# EAGLE design ESP-32-UNICLOCK-Nixi-V2 (EAGLE 6.3)
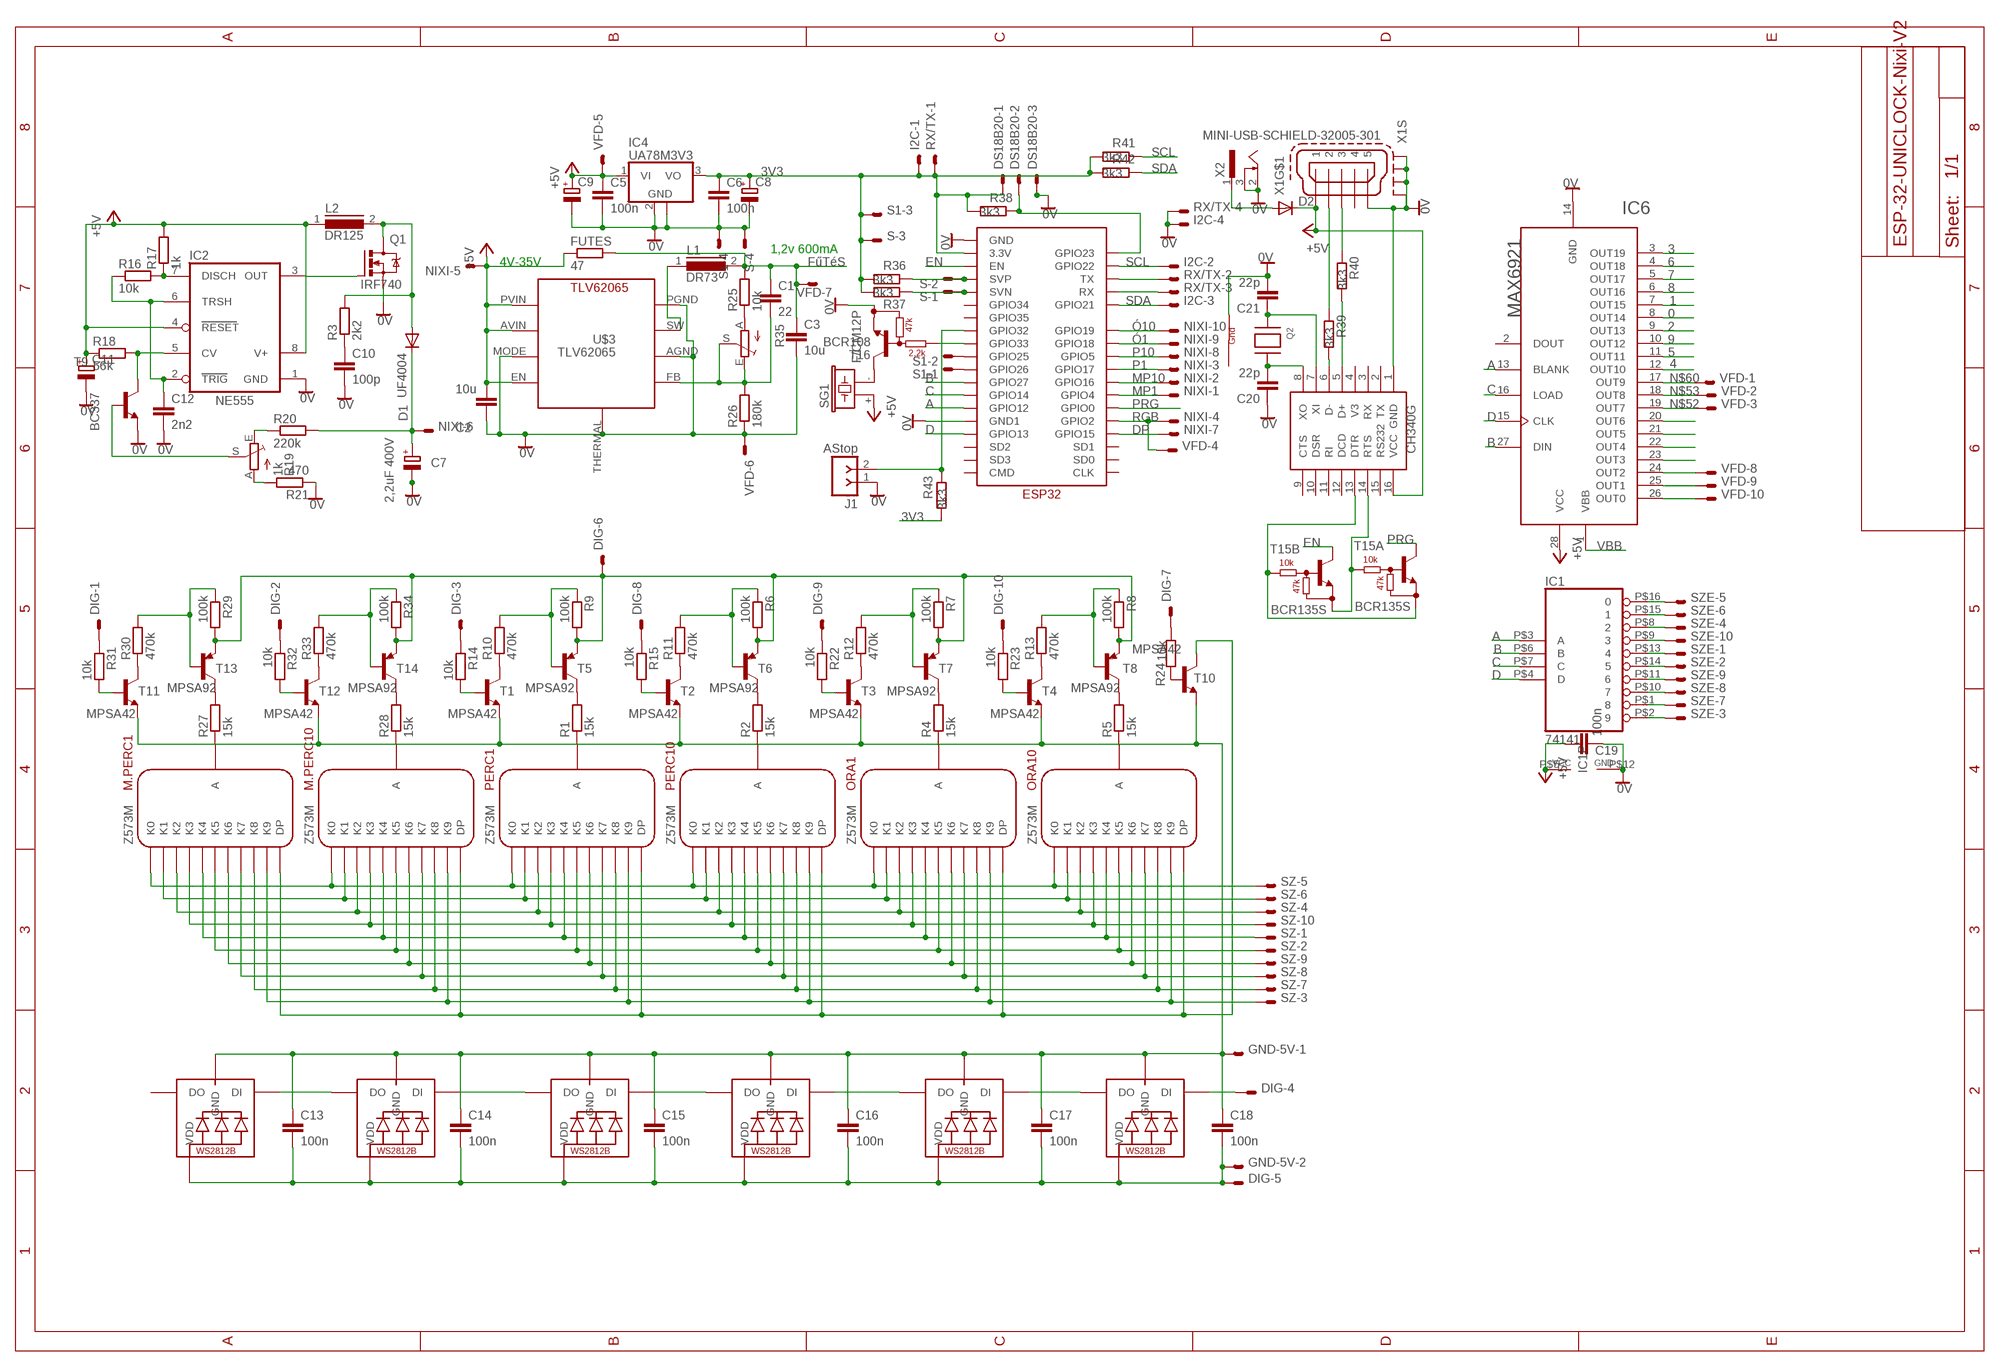
[diagram p0: schematic, sheet 1]

## Parts
C1  22  C0603  [0603]
C2  10u  C1206  [1206]
C3  10u  C1206  [1206]
C5  100n  C0603  [0603]
C6  100n  C0603  [0603]
C7  2,2uF 400V  CPOL-EUE2.5-7  [E2,5-7]
C8  CPOL-EUE2.5-5  [E2,5-5]
C9  CPOL-EUE2.5-5  [E2,5-5]
C10  100p  C-EU050-024X044  [C050-024X044]
C11  CPOL-EUE2.5-7  [E2,5-7]
C12  2n2  C-EUC0603  [C0603]
C13  100n  C-EUC0603  [C0603]
C14  100n  C-EUC0603  [C0603]
C15  100n  C-EUC0603  [C0603]
C16  100n  C-EUC0603  [C0603]
C17  100n  C-EUC0603  [C0603]
C18  100n  C-EUC0603  [C0603]
C19  100n  C0603  [0603]
C20  22p  C0603  [0603]
C21  22p  C0603  [0603]
D1  UF4004  BA221  [DO35-10]
D2  DIODE-SOD123  [SOD123]
DIG  DIG  PAD10  [PAD10]
DS18B20  PAD3  [PAD3]
FUTES  47  R-EU_0207/10  [0207/10]
GND-5V  PAD2  [PAD2]
I2C  PAD4  [PAD4]
IC1  74141  [DIL16SMD]
IC2  NE555  ICM7555  [DIL08]
IC4  UA78M3V3  UA78M05DCY  [SOT223]
IC6  MAX6921  MAX6921SOIC28W  [SO-28W]
J1  AStop  F-1X02-SIP-100-32  [SIP-100-02-32]
L1  DR73  [DR73]
L2  DR125  [DR125]
LED1  WS2812B_5050N  [WS2812B-NARROW]
LED2  WS2812B_5050N  [WS2812B-NARROW]
LED3  WS2812B_5050N  [WS2812B-NARROW]
LED4  WS2812B_5050N  [WS2812B-NARROW]
LED5  WS2812B_5050N  [WS2812B-NARROW]
LED6  WS2812B_5050N  [WS2812B-NARROW]
M.PERC1  MP1  Z573SZ1  [Z573SZ1]
M.PERC10  MP10  Z573SZ1  [Z573SZ1]
NIXI  PAD10  [PAD10]
ORA1  O1  Z573SZ1  [Z573SZ1]
ORA10  O10  Z573SZ1  [Z573SZ1]
PERC1  P1  Z573SZ1  [Z573SZ1]
PERC10  P10  Z573SZ1  [Z573SZ1]
Q1  IRF740  [TO220BV]
Q2  XTAL-4-3225  [NX3225]
R1  15k  R-EU_0207/7  [0207/7]
R2  15k  R-EU_0207/7  [0207/7]
R3  2k2  R-EU_0204/7  [0204/7]
R4  15k  R-EU_0207/7  [0207/7]
R5  15k  R-EU_0207/7  [0207/7]
R6  100k  R-EU_0207/7  [0207/7]
R7  100k  R-EU_0207/7  [0207/7]
R8  100k  R-EU_0207/7  [0207/7]
R9  100k  R-EU_0207/7  [0207/7]
R10  470k  R-EU_0207/7  [0207/7]
R11  470k  R-EU_0207/7  [0207/7]
R12  470k  R-EU_0207/7  [0207/7]
R13  470k  R-EU_0207/7  [0207/7]
R14  10k  R-EU_0207/7  [0207/7]
R15  10k  R-EU_0207/7  [0207/7]
R16  10k  R-EU_R0603  [R0603]
R17  1k  R-EU_R0603  [R0603]
R18  56k  R-EU_R0603  [R0603]
R19  1k  TRIM_EU-CA6H  [CA6H]
R20  220k  R-EU_0204/7  [0204/7]
R21  470  R-EU_0204/7  [0204/7]
R22  10k  R-EU_0207/7  [0207/7]
R23  10k  R-EU_0207/7  [0207/7]
R24  10k  R-EU_0207/7  [0207/7]
R25  10k  R0603  [0603]
R26  180k  R0603  [0603]
R27  15k  R-EU_0207/7  [0207/7]
R28  15k  R-EU_0207/7  [0207/7]
R29  100k  R-EU_0207/7  [0207/7]
R30  470k  R-EU_0207/7  [0207/7]
R31  10k  R-EU_0207/7  [0207/7]
R32  10k  R-EU_0207/7  [0207/7]
R33  470k  R-EU_0207/7  [0207/7]
R34  100k  R-EU_0207/7  [0207/7]
R35  TRIM_EU-B25P  [B25P]
R36  3k3  R0603  [0603]
R37  3k3  R0603  [0603]
R38  3k3  R0603  [0603]
R39  3k3  R0603  [0603]
R40  3k3  R0603  [0603]
R41  3k3  R0603  [0603]
R42  3k3  R0603  [0603]
R43  3k3  R0603  [0603]
RX/TX  PAD4  [PAD4]
S  PAD4  [PAD4]
S1  PAD4  [PAD4]
SG1  F/CM12P  [F/CM12P]
SZ  PAD10  [PAD10]
SZE  PAD10  [PAD10]
T1  MPSA42  BC317-NPN-TO92-EBC  [TO92-EBC]
T2  MPSA42  BC317-NPN-TO92-EBC  [TO92-EBC]
T3  MPSA42  BC317-NPN-TO92-EBC  [TO92-EBC]
T4  MPSA42  BC317-NPN-TO92-EBC  [TO92-EBC]
T5  MPSA92  BC328-PNP-TO92-EBC  [TO92-EBC]
T6  MPSA92  BC328-PNP-TO92-EBC  [TO92-EBC]
T7  MPSA92  BC328-PNP-TO92-EBC  [TO92-EBC]
T8  MPSA92  BC328-PNP-TO92-EBC  [TO92-EBC]
T9  BC337  BC237-NPN-TO92-CBE  [TO92-CBE]
T10  MPSA42  BC317-NPN-TO92-EBC  [TO92-EBC]
T11  MPSA42  BC317-NPN-TO92-EBC  [TO92-EBC]
T12  MPSA42  BC317-NPN-TO92-EBC  [TO92-EBC]
T13  MPSA92  BC328-PNP-TO92-EBC  [TO92-EBC]
T14  MPSA92  BC328-PNP-TO92-EBC  [TO92-EBC]
T15  BCR135S  [SOT363_INFINEON]
T16  BCR108  [SOT23-BEC]
U$1  CH340G  [SOIC16]
U$2  ESP32-2X18  [ESP322X18]
U$3  TLV62065  [TLV62065]
VFD  PAD10  [PAD10]
X1  MINI-USB-SCHIELD-32005-301  [32005-301]
X2  733989-5  [733989-5]

## Nets
0: IC1.P$16 IC6.8(OUT14) SZE.P$5
0V: C2.2 C3.2 C5.2 C6.2 C7.- C8.- C9.- C10.2 C11.- C12.2 C19.2 C20.1 C21.2 DS18B20.P$3 I2C.P$4 IC1.P$12(GND) IC2.1(GND) IC4.2(GND) IC4.4(GND) IC6.14(GND) J1.1 Q1.S Q2.4(G1) R21.1 R26.1 RX/TX.P$4 S1.P$4 S.P$4 T9.E T16.E U$1.1(GND) U$2.P$19(GND) U$2.P$26(GND1) U$3.AGND U$3.MODE U$3.PGND U$3.THERMAL VFD.P$6 X1.5 X1.M1(S:S1) X1.M2(S:S2) X1.M3(S:S3) X1.M4(S:S4) X2.2 X2.3
1: IC1.P$15 IC6.7(OUT15) SZE.P$6
2: IC1.P$8 IC6.9(OUT13) SZE.P$4
3: IC1.P$9 IC6.3(OUT19) SZE.P$10
3V3: C6.1 C8.+ DS18B20.P$1 I2C.P$1 IC4.3(VO) R36.2 R37.2 R38.2 R41.2 R42.2 R43.2 RX/TX.P$1 S1.P$3 S.P$3 U$2.P$20(3.3V)
4: IC1.P$13 IC6.12(OUT10) SZE.P$1
5: IC1.P$14 IC6.11(OUT11) SZE.P$2
6: IC1.P$11 IC6.4(OUT18) SZE.P$9
7: IC1.P$10 IC6.5(OUT17) SZE.P$8
8: IC1.P$1 IC6.6(OUT16) SZE.P$7
9: IC1.P$2 IC6.10(OUT12) SZE.P$3
+5V: C2.1 C5.1 C9.+ C11.+ C19.1 D2.C FUTES.1 IC1.P$5(VCC) IC2.4(RESET) IC2.8(V+) IC4.1(VI) IC6.28(VCC) L2.1 NIXI.P$5 R17.2 R18.1 SG1.+ U$1.16(VCC) U$3.AVIN U$3.EN U$3.PVIN VFD.P$5 X1.1
A: IC1.P$3(A) IC6.13(BLANK) U$2.P$12(GPIO12)
B: IC1.P$6(B) IC6.27(DIN) U$2.P$10(GPIO27)
C: IC1.P$7(C) IC6.16(LOAD) U$2.P$9(GPIO14)
D: IC1.P$4(D) IC6.15(CLK) U$2.P$11(GPIO13)
DP: NIXI.P$7 U$2.P$35(GPIO15)
EN: T15.3(B:C) U$2.P$21(EN)
FűTéS: C1.1 C3.1 FUTES.2 L1.2 R25.2 VFD.P$7
GND1: C13.1 C14.1 C15.1 C16.1 C17.1 C18.1 GND-5V.P$1 LED1.3-GND(GND) LED2.3-GND(GND) LED3.3-GND(GND) LED4.3-GND(GND) LED5.3-GND(GND) LED6.3-GND(GND) T1.E T2.E T3.E T4.E T10.E T11.E T12.E
MP1: NIXI.P$1 U$2.P$34(GPIO4)
MP10: NIXI.P$2 U$2.P$31(GPIO16)
N$1: T15.1(A:E) T15.5(B:B) U$1.13(DTR)
N$2: S1.P$1 U$2.P$7(GPIO26)
N$3: IC6.26(OUT0) VFD.P$10
N$4: IC6.25(OUT1) VFD.P$9
N$6: L1.1 U$3.SW
N$8: IC6.24(OUT2) VFD.P$8
N$10: PERC1.A R1.1
N$11: PERC10.A R2.1
N$12: ORA1.A R4.1
N$13: ORA10.A R5.1
N$14: R1.2 T5.C
N$15: R2.2 T6.C
N$16: R4.2 T7.C
N$17: R5.2 T8.C
N$18: R19.E R20.1
N$19: R10.1 T1.C
N$20: R19.A R21.2
N$21: R9.1 R10.2 T5.B
N$22: IC2.3(OUT) Q1.G
N$23: IC2.7(DISCH) R16.2 R17.1
N$24: C12.1 IC2.2(TRIG) IC2.6(TRSH) R16.1
N$25: R6.1 R11.2 T6.B
N$26: IC2.5(CV) R18.2 T9.C
N$27: C10.1 R3.1
N$28: R37.1 S.P$1 U$2.P$1(SVN)
N$29: R7.1 R12.2 T7.B
N$30: R8.1 R13.2 T8.B
N$31: R11.1 T2.C
N$32: R12.1 T3.C
N$33: R13.1 T4.C
N$34: R14.2 T1.B
N$35: R15.2 T2.B
N$36: R22.2 T3.B
N$37: R23.2 T4.B
N$38: R24.2 T10.B
N$39: DIG.P$1 R31.1
N$40: DIG.P$6 R6.2 R7.2 R8.2 R9.2 R29.2 R34.2 T5.E T6.E T7.E T8.E T13.E T14.E
N$41: DIG.P$2 R32.1
N$42: M.PERC1.K0 M.PERC10.K0 ORA1.K0 ORA10.K0 PERC1.K0 PERC10.K0 SZ.P$5
N$43: IC6.23(OUT3)
N$44: D1.A L2.2 Q1.D R3.2
N$45: M.PERC1.K1 M.PERC10.K1 ORA1.K1 ORA10.K1 PERC1.K1 PERC10.K1 SZ.P$6
N$46: DS18B20.P$2 R38.1 U$2.P$23(GPIO23)
N$47: DIG.P$8 R15.1
N$48: DIG.P$10 R23.1
N$49: IC6.22(OUT4)
N$50: IC6.21(OUT5)
N$51: IC6.20(OUT6)
N$52: IC6.19(OUT7) VFD.P$3
N$53: IC6.18(OUT8) VFD.P$2
N$54: LED1.2-DOUT(DO) LED2.4-DIN(DI)
N$55: LED2.2-DOUT(DO) LED3.4-DIN(DI)
N$56: M.PERC1.K2 M.PERC10.K2 ORA1.K2 ORA10.K2 PERC1.K2 PERC10.K2 SZ.P$4
N$57: M.PERC1.K3 M.PERC10.K3 ORA1.K3 ORA10.K3 PERC1.K3 PERC10.K3 SZ.P$10
N$58: M.PERC1.K4 M.PERC10.K4 ORA1.K4 ORA10.K4 PERC1.K4 PERC10.K4 SZ.P$1
N$59: M.PERC1.K5 M.PERC10.K5 ORA1.K5 ORA10.K5 PERC1.K5 PERC10.K5 SZ.P$2
N$60: IC6.17(OUT9) VFD.P$1
N$61: M.PERC1.K6 M.PERC10.K6 ORA1.K6 ORA10.K6 PERC1.K6 PERC10.K6 SZ.P$9
N$62: M.PERC1.K7 M.PERC10.K7 ORA1.K7 ORA10.K7 PERC1.K7 PERC10.K7 SZ.P$8
N$63: M.PERC1.K8 M.PERC10.K8 ORA1.K8 ORA10.K8 PERC1.K8 PERC10.K8 SZ.P$7
N$64: M.PERC1.K9 M.PERC10.K9 ORA1.K9 ORA10.K9 PERC1.K9 PERC10.K9 SZ.P$3
N$65: LED3.2-DOUT(DO) LED4.4-DIN(DI)
N$66: LED4.2-DOUT(DO) LED5.4-DIN(DI)
N$67: DIG.P$9 R22.1
N$68: DIG.P$7 R24.1
N$69: DIG.P$3 R14.1
N$70: D2.A X2.1
N$71: DIG.P$4 LED1.4-DIN(DI)
N$72: R36.1 S.P$2 U$2.P$2(SVP)
N$73: S1.P$2 U$2.P$8(GPIO25)
N$74: R39.1 X1.2
N$75: R40.2 U$1.5(D+)
N$76: R39.2 U$1.6(D-)
N$77: R40.1 X1.3
N$78: LED5.2-DOUT(DO) LED6.4-DIN(DI)
N$79: T15.2(A:B) T15.4(B:E) U$1.14(RTS)
N$80: C20.2 Q2.3(X2) U$1.8(XO)
N$81: C13.2 C14.2 C15.2 C16.2 C17.2 C18.2 DIG.P$5 GND-5V.P$2 LED1.1-VDD(VDD) LED2.1-VDD(VDD) LED3.1-VDD(VDD) LED4.1-VDD(VDD) LED5.1-VDD(VDD) LED6.1-VDD(VDD)
N$82: M.PERC1.A R27.1
N$83: M.PERC10.A R28.1
N$84: R27.2 T13.C
N$85: R28.2 T14.C
N$86: R30.1 T11.C
N$87: R31.2 T11.B
N$88: R32.2 T12.B
N$89: C21.1 Q2.1(X1) U$1.7(XI)
N$90: R29.1 R30.2 T13.B
N$91: R33.2 R34.1 T14.B
N$92: RX/TX.P$2 U$2.P$22(TX)
N$93: RX/TX.P$3 U$2.P$24(RX)
N$94: SG1.- T16.C
N$95: T16.B U$2.P$5(GPIO33)
N$96: J1.2 R43.1 U$2.P$6(GPIO32)
N$98: R25.1 R35.A
N$99: C1.2 R26.2 R35.E R35.S U$3.FB
N$104: R33.1 T12.C
N$105: M.PERC1.DP M.PERC10.DP ORA1.DP ORA10.DP PERC1.DP PERC10.DP T10.C
N$119: R19.S T9.B
P1: NIXI.P$3 U$2.P$32(GPIO17)
P10: NIXI.P$8 U$2.P$29(GPIO5)
PRG: T15.6(A:C) U$2.P$33(GPIO0)
RGB: NIXI.P$4 U$2.P$36(GPIO2) VFD.P$4
SCL: I2C.P$2 R41.1 U$2.P$25(GPIO22)
SDA: I2C.P$3 R42.1 U$2.P$28(GPIO21)
VBB: C7.+ D1.C IC6.1(VBB) NIXI.P$6 R20.2
Ó1: NIXI.P$9 U$2.P$30(GPIO18)
Ó10: NIXI.P$10 U$2.P$27(GPIO19)
Unconnected: IC6.2(DOUT) LED6.2-DOUT(DO) U$1.2(TX) U$1.3(RX) U$1.4(V3) U$1.9(CTS) U$1.10(DSR) U$1.11(RI) U$1.12(DCD) U$1.15(RS232) U$2.P$3(GPIO35) U$2.P$4(GPIO34) U$2.P$13(SD3) U$2.P$14(SD2) U$2.P$15(CLK) U$2.P$16(CMD) U$2.P$17(SD1) U$2.P$18(SD0) X1.4

## Notes on the sheet
- 1,2v 600mA
- 4V-35V

## Power pins joined to a net without a drawn wire
G2: Q2.2(G2)

## Library data of the parts
C1-C3 C5 C6 C19-C21 =  Zozo:C
C7-C9 C11 = resistor:CPOL-EU: POLARIZED CAPACITOR, European symbol
C10 C12-C18 = resistor:C-EU: CAPACITOR, European symbol
D1 = diode:BA221: DIODE high speed (Philips)
D2 = diode:DIODE-: DIODE
DIG NIXI SZ SZE VFD = tuskesor:PAD10
DS18B20 = tuskesor:PAD3
FUTES R1-R18 R20-R24 R27-R34 = resistor:R-EU_: RESISTOR, European symbol
GND-5V = tuskesor:PAD2
I2C RX/TX S S1 = tuskesor:PAD4
IC1 = 74xx-eu:74*141: BCD to decimal DECODER/DRIVER
IC2 = maxim1:ICM7555: TIMER; MF: MAXIM; MPN: ICM7555IPA+; OC_FARNELL: 9663762; OC_NEWARK: 68K4387
IC4 = linear:UA78M*: POSITIVE-VOLTAGE REGULATORS Source: http://focus.ti.com/lit/ds/symlink/ua78m33.pdf
IC6 = JVN:MAX6921
J1 = con-headers-jp:F-1X02-: FEMALE HEADER
L1 = inductors:DR73: High Power Density, High Efficiency, Shielded Inductors Source: coiltronics_dr_series.pdf
L2 = inductors:DR125: High Power Density, High Efficiency, Shielded Inductors Source: coiltronics_dr_series.pdf
LED1-LED6 = adafruit:WS2812B
M.PERC1 M.PERC10 ORA1 ORA10 PERC1 PERC10 =    Z573M:Z573SZ1
Q1 = transistor-power:IRF740: N-CHANNEL MOS FET
Q2 = adafruit:XTAL-4: Classic 4-pin 3.2 x 2.5mm crystal
R19 R35 = pot:TRIM_EU-: POTENTIOMETER
R25 R26 R36-R43 =  Zozo:R
SG1 = buzzer:F/CM12P: BUZZER Source: Buerklin; OC_FARNELL: unknown; OC_NEWARK: unknown
T1-T4 T9-T12 = transistor:*-NPN-: NPN Transistror BF959 corrected 2008.03.06
T5-T8 T13 T14 = transistor:*-PNP-: PNP Transistror
T15 = digital-transistors-1:BCR135S: Dual NPN Silicon Digital Transistor 50V 0,1A 0,25W
T16 = digital-transistors:BCR108: NPN Silicon Digital Transistor 50V 0,1A 0,2W
U$1 = ch340g:CH340G
U$2 = ESP32:ESP32-2X18
U$3 = LMR23630:TLV62065
X1 = con-cypressindustries:MINI-USB-SCHIELD-: MINI USB-B Conector Source: www.cypressindustries.com; OC_FARNELL: unknown; OC_NEWARK: unknown
X2 = con-conrad:73398?: FEMALE PRINT CONNECTOR Niedervolt-Steckverbinder Distributor Conrad

## Board
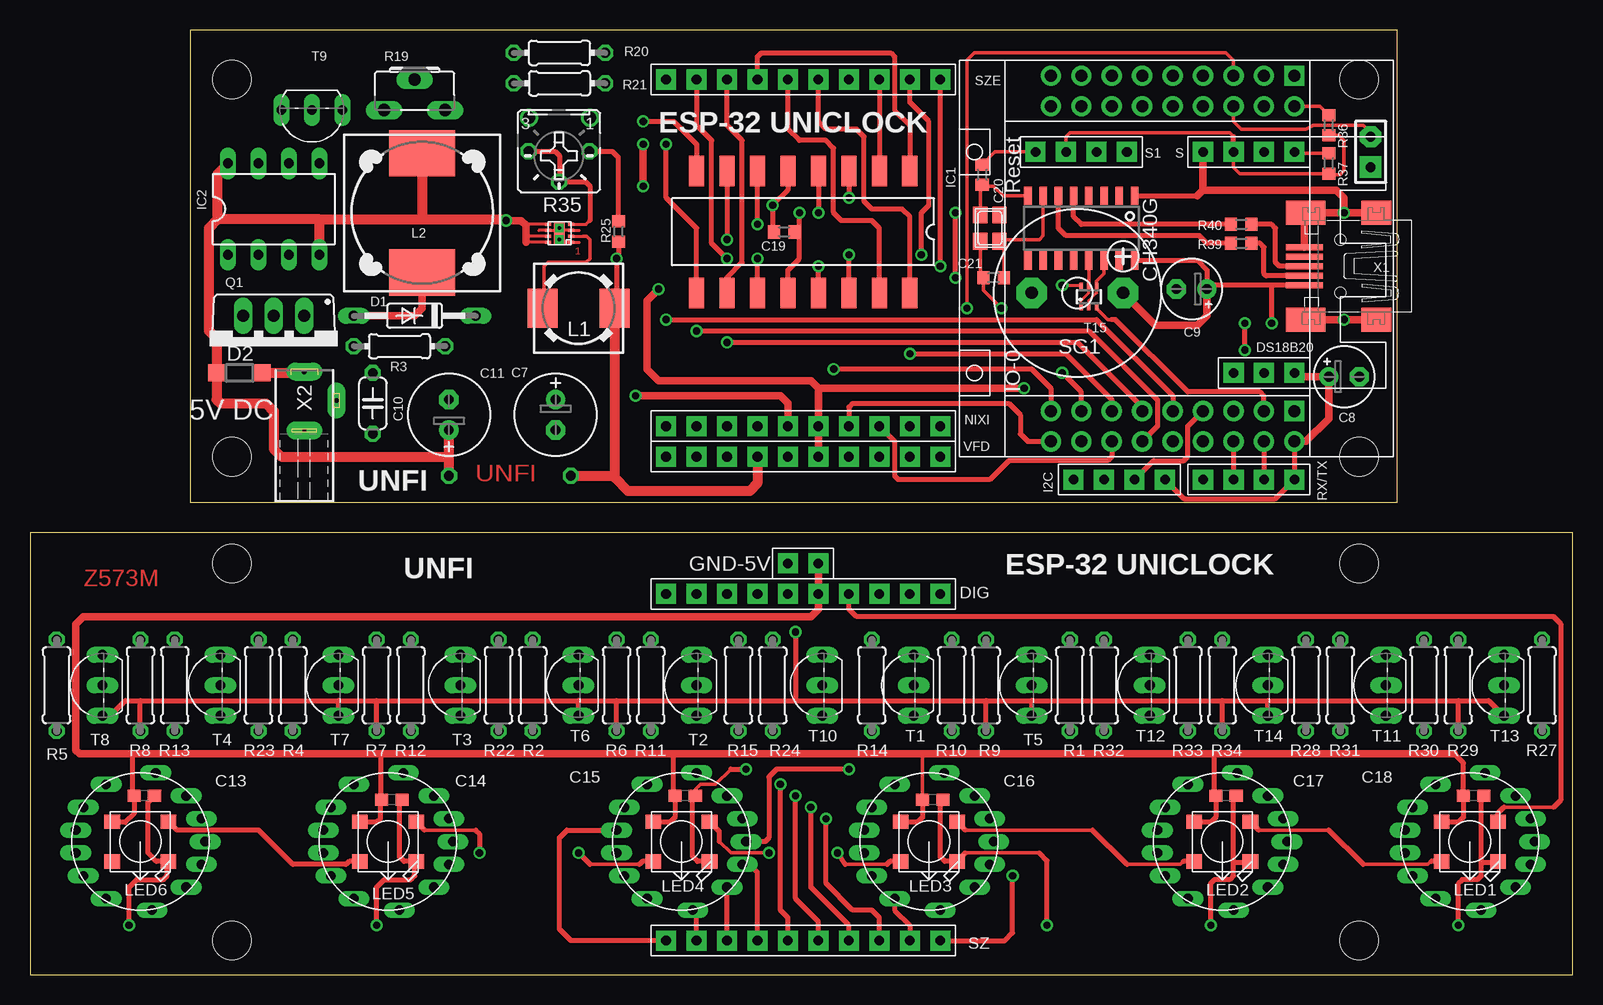
[diagram p1: board, top side]
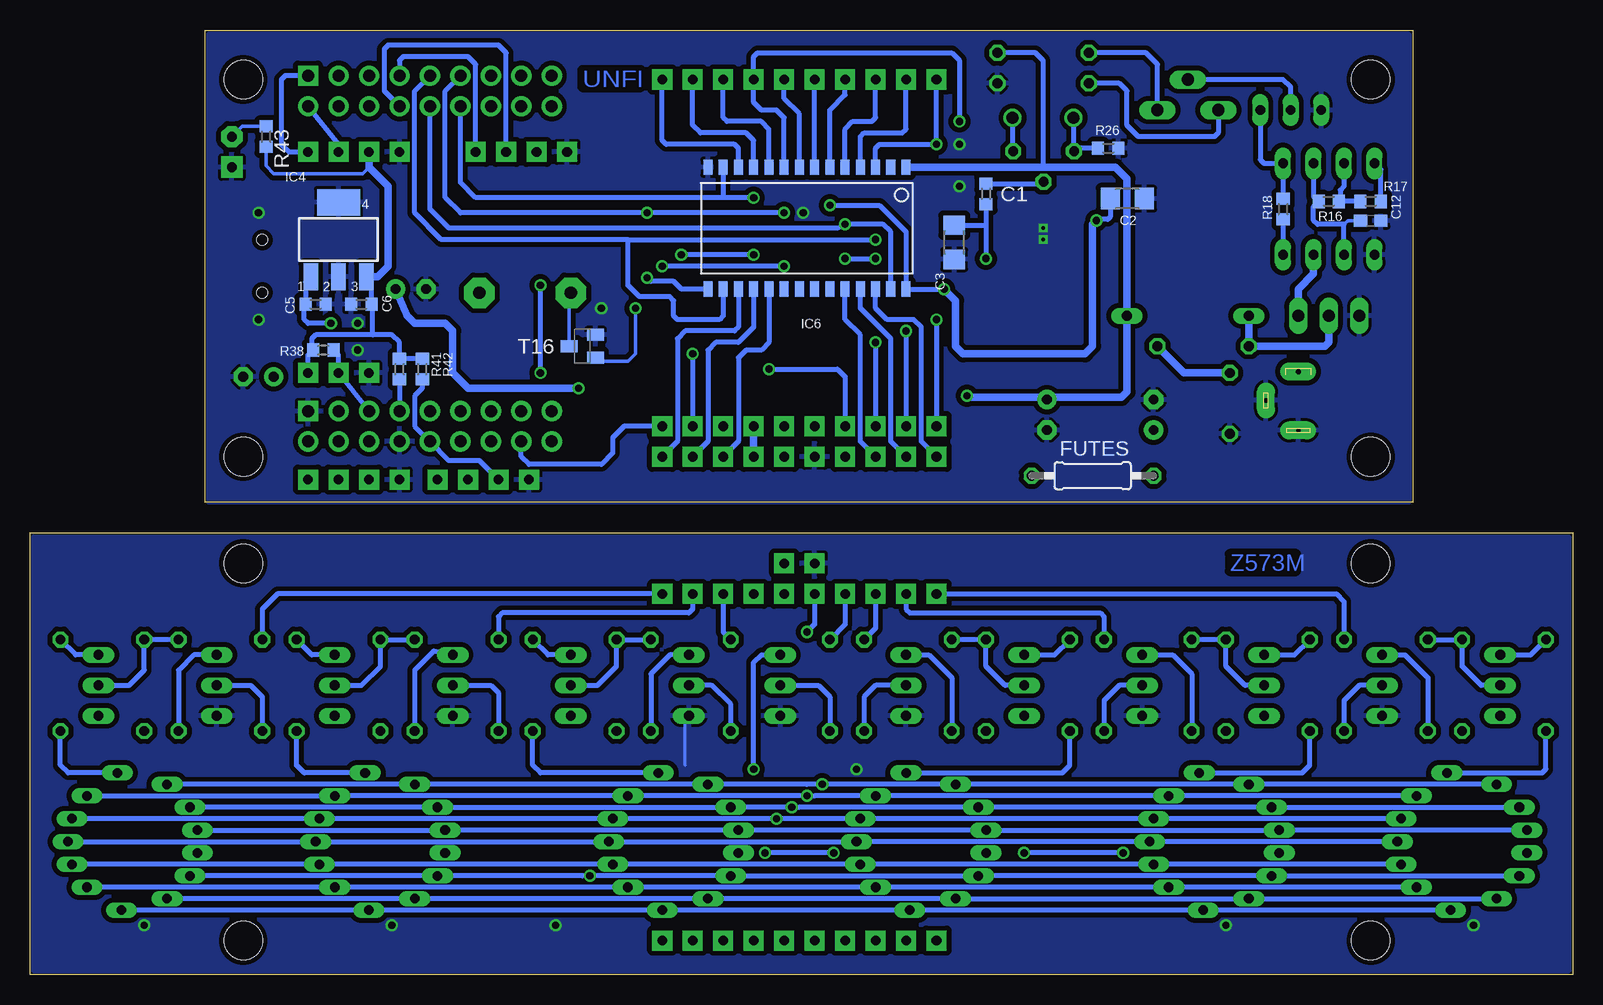
[diagram p2: board, bottom side, seen from below]

Size 128.59 x 78.74 mm. Coordinates in mm from the lower left corner, seen from the top.
Outline: 0,0 128.59,0 128.59,36.83 0,36.83 0,0
Outline: 13.33,39.37 113.98,39.37 113.98,78.74 13.33,78.74 13.33,39.37
Copper layers (1*16): Top 0.035mm / dielectric 1.5mm / Bottom 0.035mm
Design rules "default *": minimum track width 10mil, minimum drill 24mil, track to track 8mil, track to pad 8mil, pad to pad 8mil, via to via 8mil, smd to smd 8mil, copper to edge 0mil, drill to drill 8mil, minimum pad ring 10mil, minimum via ring 8mil, stop-mask expansion 4mil, vias tented up to drill 0mil, thermal gap 10mil
Holes 3.2 mm at 16.83,74.61 16.83,43.18 110.81,43.18 110.81,74.61 110.81,34.29 16.83,34.29 16.83,2.86 110.81,2.86

### Footprints (pad centres in the part's own frame; a part is rotated, then mirrored left to right if it is on the bottom)
0603 = smd 1 x 1.1: 1 -0.85,0; 2 0.85,0
1206 = smd 1.6 x 1.803: 1 -1.422,0; 2 1.422,0
E2,5-7 = drill 0.813 pad 1.6: + -1.27,0 | drill 0.813 pad 1.6 octagon: - 1.27,0
E2,5-5 = drill 0.813 pad 1.6: + -1.27,0 | drill 0.813 pad 1.6 octagon: - 1.27,0
C050-024X044 = drill 0.813 octagon: 1 -2.54,0; 2 2.54,0
C0603 = smd 1.1 x 1: 1 -0.85,0; 2 0.85,0
DO35-10 = drill 0.813 long: A 5.08,0; C -5.08,0
SOD123 = smd 1.4 x 1.4: A 1.9,0; C -1.9,0
PAD10 = drill 0.8 pad 1.676 square: P$1 0,0; P$2 2.54,0; P$3 5.08,0; P$4 7.62,0; P$5 10.16,0; P$6 12.7,0; P$7 15.24,0; P$8 17.78,0; P$9 20.32,0; P$10 22.86,0
PAD3 = drill 0.8 pad 1.676 square: P$1 0,0; P$2 2.54,0; P$3 5.08,0
0207/10 = drill 0.813 octagon: 1 -5.08,0; 2 5.08,0
PAD2 = drill 0.8 pad 1.676 square: P$1 0,0; P$2 2.54,0
PAD4 = drill 0.8 pad 1.676 square: P$1 0,0; P$2 2.54,0; P$3 5.08,0; P$4 7.62,0
DIL16SMD = smd 1.27 x 2.54: P$1 0,0; P$2 2.54,0; P$3 5.08,0; P$4 7.62,0; P$5 10.16,0; P$6 12.7,0; P$7 15.24,0; P$8 17.78,0; P$9 17.78,10.16; P$10 15.24,10.16; P$11 12.7,10.16; P$12 10.16,10.16; P$13 7.62,10.16; P$14 5.08,10.16; P$15 2.54,10.16; P$16 0,10.16
DIL08 = drill 0.813 long: 1 -3.81,-3.81; 2 -1.27,-3.81; 3 1.27,-3.81; 4 3.81,-3.81; 5 3.81,3.81; 6 1.27,3.81; 7 -1.27,3.81; 8 -3.81,3.81
SOT223 = smd 1.219 x 2.235: 1 -2.311,-3.099; 2 0,-3.099; 3 2.311,-3.099 | smd 3.6 x 2.2: 4 0,3.099
SO-28W = smd 0.762 x 1.27: 1 -8.255,-5.08; 2 -6.985,-5.08; 3 -5.715,-5.08; 4 -4.445,-5.08; 5 -3.175,-5.08; 6 -1.905,-5.08; 7 -0.635,-5.08; 8 0.635,-5.08; 9 1.905,-5.08; 10 3.175,-5.08; 11 4.445,-5.08; 12 5.715,-5.08; 13 6.985,-5.08; 14 8.255,-5.08; 15 8.255,5.08; 16 6.985,5.08; 17 5.715,5.08; 18 4.445,5.08; 19 3.175,5.08; 20 1.905,5.08; 21 0.635,5.08; 22 -0.635,5.08; 23 -1.905,5.08; 24 -3.175,5.08; 25 -4.445,5.08; 26 -5.715,5.08; 27 -6.985,5.08; 28 -8.255,5.08
SIP-100-02-32 = drill 0.813 pad 1.778 square: 1 -1.27,0 | drill 0.813 pad 1.778 octagon: 2 1.27,0
DR73 = smd 2.5 x 3.25: 1 -3,0; 2 3,0
DR125 = smd 3.85 x 5.5: 1 -4.975,0; 2 4.975,0
WS2812B-NARROW = smd 1.3 x 1.2: 1-VDD 2.35,-1.65; 2-DOUT 2.35,1.65; 3-GND -2.35,1.65; 4-DIN -2.35,-1.65
Z573SZ1 = drill 0.8 pad 1.27 long: A 1.27,5.715; DP 5.397,0; IC -5.397,-0.953; K0 3.81,3.81; K1 -2.857,4.763; K2 -4.763,2.857; K3 -5.397,0.953; K4 -4.763,-2.857; K5 -2.857,-4.763; K6 0.953,-5.715; K7 3.81,-3.81; K8 5.08,-1.905; K9 5.08,1.905
TO220BV = drill 1.016 long: D 0,-2.54; G -2.54,-2.54; S 2.54,-2.54
NX3225 = smd 1.4 x 1.2: 1 -1.1,-0.8; 2 1.1,-0.8; 3 1.1,0.8; 4 -1.1,0.8
0207/7 = drill 0.813 octagon: 1 -3.81,0; 2 3.81,0
0204/7 = drill 0.813 octagon: 1 -3.81,0; 2 3.81,0
R0603 = smd 1 x 1.1: 1 -0.85,0; 2 0.85,0
CA6H = drill 1.016 long: A -2.54,0; E 2.54,0; S 0,2.54
B25P = drill 0.813 octagon: A -2.54,0; E 2.54,0; S 0,2.54
F/CM12P = drill 1.016 pad 2.54 octagon: + 3.81,0; - -3.81,0
TO92-EBC = drill 0.813 long: B 0,-1.27; C 2.54,-1.27; E -2.54,-1.27
TO92-CBE = drill 0.813 long: B 0,0; C -2.54,0; E 2.54,0
SOT363_INFINEON = smd 0.3 x 0.7: 1 -0.65,-0.8; 2 0,-0.8; 3 0.65,-0.8; 4 0.65,0.8; 5 0,0.8; 6 -0.65,0.8
SOT23-BEC = smd 1 x 1.4: B -0.95,-1.1; C 0,1.1; E 0.95,-1.1
SOIC16 = smd 0.635 x 1.524: 1 -4.445,-2.695; 2 -3.175,-2.695; 3 -1.905,-2.695; 4 -0.635,-2.695; 5 0.635,-2.695; 6 1.905,-2.695; 7 3.175,-2.695; 8 4.445,-2.695; 9 4.445,2.695; 10 3.175,2.695; 11 1.905,2.695; 12 0.635,2.695; 13 -0.635,2.695; 14 -1.905,2.695; 15 -3.175,2.695; 16 -4.445,2.695
ESP322X18 = drill 1 pad 1.676 square: P$1 0,0; P$19 27.94,0 | drill 1 pad 1.676: P$2 2.54,0; P$3 0,-2.54; P$4 2.54,-2.54; P$5 0,-5.08; P$6 2.54,-5.08; P$7 0,-7.62; P$8 2.54,-7.62; P$9 0,-10.16; P$10 2.54,-10.16; P$11 0,-12.7; P$12 2.54,-12.7; P$13 0,-15.24; P$14 2.54,-15.24; P$15 0,-17.78; P$16 2.54,-17.78; P$17 0,-20.32; P$18 2.54,-20.32; P$20 30.48,0; P$21 27.94,-2.54; P$22 30.48,-2.54; P$23 27.94,-5.08; P$24 30.48,-5.08; P$25 27.94,-7.62; P$26 30.48,-7.62; P$27 27.94,-10.16; P$28 30.48,-10.16; P$29 27.94,-12.7; P$30 30.48,-12.7; P$31 27.94,-15.24; P$32 30.48,-15.24; P$33 27.94,-17.78; P$34 30.48,-17.78; P$35 27.94,-20.32; P$36 30.48,-20.32
TLV62065 = smd 0.5 x 0.25: AGND 0,0.5; AVIN 1.9,1; EN 1.9,0; FB 0,0; MODE 1.9,0.5; PGND 0,1.5; PVIN 1.9,1.5; SW 0,1 | smd 0.9 x 1.9: THERMAL 0.96,0.76
32005-301 = smd 3.1 x 0.5: 1 3,1.6; 2 3,0.8; 3 3,0; 4 3,-0.8; 5 3,-1.6 | smd 2.5 x 2: M1 -3,-4.45; M2 -3,4.45 | smd 3.3 x 2: M3 2.9,4.45; M4 2.9,-4.45 | hole 0.9: 0,2.2; 0,-2.2
733989-5 = drill 0.4 pad 1.5 long: 1 0,5.82; 3 2.7,3.42 | drill 0.3 pad 1.5 long: 2 0,0.92

### Placement (x,y rotation side)
C1  48.89,65.09 90 bottom
C2  37.1,64.69 0 bottom
C3  51.54,61.04 270 bottom
C5  104.78,55.88 0 bottom
C6  100.97,55.88 180 bottom
C7  43.81,46.67 270 top
C8  109.54,49.85 0 top
C9  96.84,57.15 180 top
C10  28.57,47.62 270 top
C11  34.92,46.67 90 top
C12  16.83,62.86 0 bottom
C13  9.52,14.92 180 top
C14  30.16,14.61 180 top
C15  54.61,14.92 180 top
C16  75.25,14.61 180 top
C17  99.7,14.92 180 top
C18  120.33,14.92 180 top
C19  62.86,61.91 0 top
C20  79.38,66.67 270 top
C21  80.33,58.1 180 top
D1  32.07,54.93 180 top
D2  17.46,50.16 0 top
DIG  75.88,31.75 180 top
DS18B20  105.41,50.16 180 top
FUTES  40,41.59 180 bottom
GND-5V  63.18,34.29 0 top
I2C  94.62,41.27 180 top
IC1  73.34,66.99 180 top
IC2  20.32,63.82 0 top
IC4  102.87,61.28 0 bottom
IC6  63.82,62.23 180 bottom
J1  111.76,68.58 90 top
L1  45.72,55.56 0 top
L2  32.7,63.5 270 top
LED1  120.02,11.11 180 top
LED2  99.38,11.11 180 top
LED3  74.93,11.11 180 top
LED4  54.29,11.11 180 top
LED5  29.84,11.11 180 top
LED6  9.21,11.11 180 top
M.PERC1  120.02,11.11 0 top
M.PERC10  99.38,11.11 0 top
NIXI  75.88,45.72 180 top
ORA1  29.84,11.11 0 top
ORA10  9.21,11.11 0 top
PERC1  74.93,11.11 0 top
PERC10  54.29,11.11 0 top
Q1  20.32,52.39 180 top
Q2  80.01,62.23 90 top
R1  86.68,24.13 90 top
R2  41.91,24.13 90 top
R3  30.8,52.39 180 top
R4  21.91,24.13 90 top
R5  2.22,24.13 90 top
R6  48.89,24.13 270 top
R7  28.89,24.13 270 top
R8  9.21,24.13 270 top
R9  79.69,24.13 270 top
R10  76.83,24.13 90 top
R11  51.75,24.13 90 top
R12  31.75,24.13 90 top
R13  12.06,24.13 90 top
R14  70.17,24.13 270 top
R15  59.06,24.13 270 top
R16  20.32,64.45 0 bottom
R17  16.83,64.45 0 bottom
R18  24.13,63.82 90 bottom
R19  32.07,72.07 0 top
R20  44.13,76.84 0 top
R21  44.13,74.3 180 top
R22  39.05,24.13 270 top
R23  19.05,24.13 270 top
R24  61.91,24.13 270 top
R25  49.06,61.95 270 top
R26  38.7,68.87 180 bottom
R27  126.05,24.13 90 top
R28  106.36,24.13 90 top
R29  119.06,24.13 270 top
R30  116.2,24.13 90 top
R31  109.22,24.13 270 top
R32  89.53,24.13 270 top
R33  96.52,24.13 90 top
R34  99.38,24.13 270 top
R35  44.09,68.64 180 top
R36  108.27,70.8 270 top
R37  108.27,67.63 270 top
R38  104.14,52.07 180 bottom
R39  100.97,60.96 180 top
R40  100.97,62.55 180 top
R41  97.79,50.48 90 bottom
R42  95.89,50.48 90 bottom
R43  108.9,69.85 270 bottom
RX/TX  105.41,41.27 180 top
S  105.41,68.58 180 top
S1  91.44,68.58 180 top
SG1  87.31,56.83 0 top
SZ  75.88,2.86 180 top
SZE  75.88,74.61 180 top
T1  72.39,24.13 90 top
T2  54.29,24.13 90 top
T3  34.61,24.13 90 top
T4  14.61,24.13 90 top
T5  82.23,24.13 90 top
T6  44.45,24.13 90 top
T7  24.45,24.13 90 top
T8  4.76,24.13 90 top
T9  23.49,72.07 180 top
T10  64.77,24.13 90 top
T11  111.76,24.13 90 top
T12  92.08,24.13 90 top
T13  121.6,24.13 90 top
T14  101.92,24.13 90 top
T15  88.27,56.52 0 top
T16  82.55,52.39 90 bottom
U$1  87.63,62.23 180 top
U$2  105.41,74.93 270 top
U$3  45.09,62.55 180 top
VFD  75.88,43.18 180 top
X1  109.22,59.05 180 top
X2  22.86,44.45 0 top

### Tracks (layer width: path | path; a pad name or v marks a point on that pad's centre or on a via)
0
  Top 0.406: IC1.P$16 73.34,63.18 72.71,63.82 70.17,63.82 69.53,64.45 69.53,69.85 68.9,70.49 66.36,70.49 65.72,71.12 SZE.P$5
  Bottom 0.406: IC6.8 64.45,71.75 65.72,73.03 SZE.P$5
0V  (via drill 0.3, 0.6)
  Top 0.254: U$3.MODE 44.13,62.05 | U$3.AGND 44.13,62.05 | 44.13,62.05 U$3.THERMAL v44.13,62.23 | U$3.PGND 44.13,61.05 v44.13,61.28
  Top 0.305: S1.P$4 80.43,68.58 C20.1 | Q2.4 79.21,58.37 C21.2 79.48,57.05 v80.96,55.56
  Top 0.406: IC1.P$12 63.18,58.74 64.14,59.69 64.14,61.91 | 64.14,61.91 v64.14,63.5 | C19.2 64.14,61.91 | U$1.1 97.31,64.92 | v101.28,52.07 v101.28,54.29
  Top 0.61: v51.12,65.72 v51.12,69.21 | X1.M2 v109.54,54.6 v109.54,54.61 v109.53,54.6 X1.M3 | X1.M1 v109.54,63.5 | v109.54,63.5 v109.53,63.5 X1.M4 106.22,63.41 X1.5 | S.P$4 97.79,65.41 | 97.79,65.41 97.31,64.92 | 97.79,65.41 108.9,65.41 109.54,64.77 v109.54,63.5
  pour Bottom (isolate 0.406): 13.65,39.37 113.67,39.37 113.67,78.42 13.65,78.42
1
  Top 0.406: IC1.P$15 70.8,62.23 70.17,62.86 67.63,62.86 66.99,63.5 66.99,68.9 66.36,69.53 64.14,69.53 63.18,70.49 SZE.P$6
  Bottom 0.406: IC6.7 SZE.P$6
2  (via drill 0.6)
  Top 0.406: v51.12,71.12 53.66,71.12 55.56,69.21 IC1.P$8
  Bottom 0.406: IC6.9 65.72,71.44 66.36,72.07 67.63,72.07 68.26,72.71 SZE.P$4 68.26,76.52 67.94,76.84 51.75,76.84 51.12,76.2 v51.12,71.12
3  (via drill 0.6)
  Top 0.406: IC1.P$9 55.56,62.23 53.02,64.77 v53.02,69.21
  Bottom 0.406: IC6.3 58.1,68.9 57.79,69.21 v53.02,69.21 SZE.P$10
3V3
  Top 0.305: S1.P$3 86.36,69.85 86.68,70.17 100.01,70.17 100.33,69.85 | S.P$3 100.33,67.31 100.86,66.78 R37.2 108.37,66.67 109.22,66.67 109.54,66.99 109.54,69.53 109.12,69.95 R36.2
  Top 0.406: S.P$3 100.33,69.85 | U$2.P$20 RX/TX.P$1 103.82,39.69 96.2,39.69 I2C.P$1
  Top 0.61: U$2.P$20 106.36,44.45 108.27,46.35 C8.+ 106.04,49.85 DS18B20.P$1
  Bottom 0.305: R43.2 108.9,67.41 R37.2 100.86,66.78 100.49,67.15 100.49,68.42 S.P$3
  Bottom 0.406: IC4.3 100.12,57.74 C6.1 100.01,55.78 100.01,53.34 | DS18B20.P$1 105.41,51.65 R38.2 105.09,52.17 105.09,53.02 104.78,53.34 100.01,53.34 | R42.2 R41.2 97.79,52.71 98.42,53.34 100.01,53.34
  Bottom 0.61: IC4.3 99.62,58.18 98.74,59.06 98.74,65.72 100.33,67.31 S.P$3
4  (via drill 0.6)
  Top 0.406: IC1.P$13 v65.72,59.06 | v75.88,59.06 SZE.P$1
  Bottom 0.406: v65.72,59.06 v75.88,59.06 | IC6.12 69.53,68.9 69.85,69.21 75.57,69.21 75.88,69.53 SZE.P$1
5  (via drill 0.6)
  Top 0.406: IC1.P$14 v68.26,60.01 | v74.29,60.01 74.29,63.5 74.93,64.13 74.93,71.12 73.34,72.71 SZE.P$2
  Bottom 0.406: IC6.11 68.26,69.53 68.9,70.17 72.71,70.17 73.34,70.8 SZE.P$2 | v68.26,60.01 v74.29,60.01
6  (via drill 0.6)
  Top 0.406: SZE.P$9 55.56,70.8 56.83,69.53 56.83,60.96 v58.1,59.69 | IC1.P$11 v60.64,59.69
  Bottom 0.406: IC6.4 59.37,69.85 59.06,70.17 55.88,70.17 55.56,70.49 SZE.P$9 | v60.64,59.69 v58.1,59.69
7
  Top 0.406: IC1.P$10 58.1,58.1 59.37,59.37 59.37,69.53 58.1,70.8 SZE.P$8
  Bottom 0.406: IC6.5 60.64,70.49 60.01,71.12 58.42,71.12 58.1,71.44 SZE.P$8
8
  Top 0.406: SZE.P$7 60.64,76.52 60.96,76.84 71.75,76.84 72.07,76.52 72.07,72.07 73.34,70.8 IC1.P$1
  Bottom 0.406: IC6.6 61.91,72.07 60.64,73.34 SZE.P$7
9
  Top 0.406: SZE.P$3 IC1.P$2
  Bottom 0.406: IC6.10 66.99,70.49 67.63,71.12 70.49,71.12 70.8,71.44 SZE.P$3
+5V  (via drill 0.6)
  Top 0.254: U$3.EN 41.59,62.55 | 41.32,61.55 U$3.AVIN 41.41,61.55 41.36,61.6 | U$3.PVIN 41.36,61.05
  Top 0.305: 41.59,62.55 41.45,62.55 41.36,62.46
  Top 0.406: IC1.P$5 63.18,65.41 v61.91,64.13 61.91,62.02 C19.1 | U$1.16 97.31,59.53 98.11,58.74 C9.+ 98.41,57.46 103.51,57.46 | X1.1 103.51,57.46 | v103.51,54.29 103.51,57.46
  Top 0.61: v52.39,57.15 51.43,56.2 51.43,50.48 52.39,49.53 65.09,49.53 65.72,48.89 | 39.59,62.97 v39.69,62.86 40.96,62.86 41.36,62.46 41.36,61.6 41.36,61.05 | 65.72,48.89 v82.87,48.89 | 65.72,48.89 NIXI.P$5 VFD.P$5 | D2.C | SG1.+ 93.82,54.13 97.31,54.13 98.11,54.93 C9.+
  Top 0.813: 32.7,62.97 39.59,62.97 | L2.1 32.7,62.97 | R18.1 15.66,62.97 | IC2.4 R18.1 | R18.1 32.7,62.97 | 34.93,43.18 20.96,43.18 20.32,43.81 20.32,46.99 19.68,47.63 15.88,47.63 15.56,47.94 D2.C 15.56,53.02 14.92,53.66 14.92,62.23 15.66,62.97 | 34.93,43.18 C11.+ | FUTES.1 34.93,43.18 | 15.66,62.97 15.66,66.78 IC2.8
  Bottom 0.406: v52.39,57.15 IC6.28 55.56,61.91 57.79,64.13 v61.91,64.13 | R17.2 15.98,67.1 IC2.8 | R18.1 IC2.4 | IC4.1 105.62,57.74 C5.1 105.73,55.78 105.73,54.61 105.41,54.29 v103.51,54.29 | C2.1 38.53,63.18 38.73,62.97 39.59,62.97 v39.69,62.86
  Bottom 0.61: v52.39,57.15 51.43,56.2 51.43,52.39 50.8,51.75 40.64,51.75 40,52.39 40,62.55 v39.69,62.86 | v82.87,48.89 92.07,48.89 93.34,50.17 93.34,53.66 93.98,54.29 96.52,54.29 97.15,54.93 C9.+
A  (via drill 0.6)
  Top 0.406: IC1.P$3 v68.26,64.77
  Bottom 0.406: v68.26,64.77 70.8,64.77 | 70.8,64.77 91.44,64.77 92.71,66.04 U$2.P$12 | IC6.13 70.8,64.77
B  (via drill 0.6)
  Top 0.406: v60.64,62.55 IC1.P$6
  Bottom 0.406: IC6.27 56.83,61.91 57.47,62.55 v60.64,62.55 61.28,62.23 93.66,62.23 95.25,63.82 U$2.P$10
C  (via drill 0.6)
  Top 0.406: IC1.P$7 v58.1,61.28
  Bottom 0.406: 78.74,61.28 94.3,61.28 96.52,63.5 96.52,73.66 U$2.P$9 | IC6.16 70.8,54.93 71.12,54.61 74.61,54.61 74.93,54.93 74.93,56.2 75.25,56.52 77.79,56.52 78.74,57.47 78.74,61.28 | 78.74,61.28 v58.1,61.28
D  (via drill 0.6)
  Top 0.406: IC1.P$4 v65.72,63.5 | v77.15,58.1 v77.15,63.5
  Bottom 0.406: v65.72,63.5 v77.15,63.5 92.71,63.5 93.98,64.77 93.98,73.66 U$2.P$11 | IC6.15 74.29,57.15 74.93,57.78 76.83,57.78 v77.15,58.1
DP  (via drill 0.6)
  Top 0.406: v66.99,50.48 83.5,50.48 85.09,48.89 U$2.P$35
  Bottom 0.406: v66.99,50.48 61.28,50.48 60.64,49.85 NIXI.P$7
EN
  Top 0.305: T15.3 88.92,55.55 89.85,54.61 90.17,54.61
  Top 0.406: U$2.P$21 102.87,48.26 102.55,48.58 96.52,48.58 90.49,54.61 90.17,54.61
FűTéS  (via drill 0.6)
  Top 0.406: L1.2 48.89,55.74 v48.89,59.69 49.06,59.85 R25.2
  Top 0.813: VFD.P$7 60.64,40.96 60.01,40.32 49.85,40.32 48.72,41.45 48.72,41.59 | L1.2 48.72,41.59 | FUTES.2 48.72,41.59
  Bottom 0.406: C1.1 48.89,62.55 | 48.89,62.55 v48.89,59.69 | C3.1 48.98,62.46 48.89,62.55
GND1  (via drill 0.6)
  Top 0.305: 84.14,10.16 77.98,10.16 | C15.1 55.46,15.46 55.88,15.87 57.15,15.87 58.42,17.15
  Top 0.406: C13.1 9.84,14.39 9.84,10.16 10.54,9.46 LED6.3-GND 11.43,9.33 11.43,8.25 11.11,7.94 8.89,7.94 8.26,7.3 v8.26,4.13 | C14.1 30.8,14.39 30.8,9.84 31.18,9.46 LED5.3-GND 32.07,9.33 32.07,8.25 31.75,7.94 29.53,7.94 28.89,7.3 v28.89,4.13 | C16.1 75.88,14.07 75.88,9.84 76.26,9.46 LED3.3-GND 77.98,10.16 | 120.97,9.21 120.97,8.25 120.65,7.94 119.38,7.94 119.06,7.62 v119.06,4.13 | 120.97,9.21 120.97,14.71 C18.1 | 100.33,9.21 100.33,8.25 100.01,7.94 98.74,7.94 98.42,7.62 v98.42,4.13 | 100.33,9.21 100.33,14.71 C17.1 | LED4.3-GND 55.62,9.46 55.25,9.84 55.25,14.71 C15.1 | LED2.3-GND 101.6,9.33 100.46,9.33 100.33,9.21 | LED1.3-GND 122.24,9.33 121.09,9.33 120.97,9.21 | v84.77,4.13 84.77,9.52 84.14,10.16 | 58.42,17.15 v59.69,17.15
  Bottom 0.254: 73.98,17.46 73.98,21.27 T1.E
  pour Bottom (isolate 0.406): 0.32,0.32 128.27,0.32 128.27,36.51 0.32,36.51
MP1
  Bottom 0.406: NIXI.P$1 79.06,45.72 80.01,44.77 80.01,43.5 80.96,42.54 87,42.54 87.63,43.18 U$2.P$34
MP10  (via drill 0.6)
  Top 0.406: v73.34,51.75 86.36,51.75 90.17,47.94 U$2.P$31
  Bottom 0.406: v73.34,51.75 NIXI.P$2
N$1
  Top 0.254: T15.1 87.62,56.18 88.26,56.83 T15.5
  Top 0.305: T15.5 U$1.13
N$2
  Bottom 0.406: S1.P$1 91.44,75.88 92.07,76.52 97.47,76.52 97.79,76.2 U$2.P$7
N$3
  Bottom 0.406: VFD.P$10 54.29,44.45 54.29,53.98 54.93,54.61 57.15,54.61 58.1,55.56 IC6.26
N$4
  Bottom 0.406: VFD.P$9 56.83,44.45 56.83,53.02 59.37,55.56 IC6.25
N$5
  Top 0.254: 45.16,62.05 45.81,62.05
N$6
  Top 0.254: U$3.SW 46.08,61.55
  Top 0.305: 46.08,61.55 46.4,61.55 46.67,61.28 46.67,59.69 46.36,59.37 43.18,59.37 42.86,59.06 42.86,55.71 L1.1
N$8
  Bottom 0.406: VFD.P$8 59.37,44.45 59.37,53.34 60.64,54.61 IC6.24
N$9
  Top 0.254: 43.01,62.05 42.4,62.05
N$10
  Bottom 0.406: PERC1.A 86.04,16.83 86.68,17.46 R1.1
N$11
  Bottom 0.406: PERC10.A 42.54,16.83 41.91,17.46 R2.1
N$12
  Bottom 0.406: ORA1.A 22.54,16.83 21.91,17.46 R4.1
N$13
  Bottom 0.406: ORA10.A 2.54,16.83 2.22,17.15 R5.1
N$14
  Bottom 0.406: T5.C 85.41,26.67 R1.2
N$15
  Bottom 0.406: T6.C 43.18,26.67 R2.2
N$16
  Bottom 0.406: T7.C 23.18,26.67 R4.2
N$17
  Bottom 0.406: T8.C 3.49,26.67 R5.2
N$18
  Bottom 0.406: R19.E 34.61,75.88 35.56,76.84 R20.1
N$19
  Bottom 0.406: T1.C 75.25,26.67 76.83,25.08 R10.1
N$20
  Bottom 0.406: R19.A 29.53,70.17 29.84,69.85 36.2,69.85 37.15,70.8 37.15,73.66 37.78,74.3 R21.2
N$21
  Bottom 0.406: T5.B 81.28,24.13 79.69,25.72 R9.1 R10.2
N$22
  Bottom 0.61: IC2.3 21.59,58.42 22.86,57.15 Q1.G
N$23
  Bottom 0.406: R17.1 R16.2 19.37,64.56 19.37,65.41 19.05,65.72 IC2.7
N$24
  Bottom 0.305: C12.1 18.73,62.86 19.05,62.55
  Bottom 0.406: IC2.6 21.59,64.87 R16.1 21.59,64.03 21.59,62.86 21.27,62.55 19.05,62.55 IC2.2
N$25
  Bottom 0.406: T6.B 47.31,24.13 48.89,25.72 R6.1 R11.2
N$26
  Bottom 0.406: R18.2 IC2.5 25.72,67.63 26.04,67.95 T9.C
N$27
  Bottom 0.61: C10.1 32.39,50.17 R3.1
N$28
  Top 0.305: R37.1 105.51,68.48 S.P$1
  Bottom 0.406: U$2.P$1 107.31,74.93 107.63,74.61 107.63,69.21 107,68.58 S.P$1
N$29
  Bottom 0.406: T7.B 27.3,24.13 28.89,25.72 R7.1 R12.2
N$30
  Bottom 0.406: R13.2 R8.1 9.21,25.72 7.62,24.13 T8.B
N$31
  Bottom 0.406: T2.C 53.66,26.67 51.75,24.77 R11.1
N$32
  Bottom 0.406: T3.C 33.34,26.67 31.75,25.08 R12.1
N$33
  Bottom 0.406: T4.C 13.97,26.67 12.07,24.77 R13.1
N$34
  Bottom 0.406: R14.2 70.17,22.54 71.75,24.13 T1.B
N$35
  Bottom 0.406: T2.B 58.1,24.13 59.06,23.18 R15.2
N$36
  Bottom 0.406: T3.B 37.78,24.13 39.05,22.86 R22.2
N$37
  Bottom 0.406: T4.B 17.78,24.13 19.05,22.86 R23.2
N$38
  Bottom 0.406: T10.B 62.86,24.13 61.91,23.18 R24.2
N$39
  Bottom 0.406: DIG.P$1 107.95,31.75 109.22,30.48 R31.1
N$40  (via drill 0.6)
  Top 0.406: T8.E 6.67,21.59 7.94,22.86 9.21,22.86 | 9.21,22.86 25.72,22.86 | 25.72,22.86 28.89,22.86 | 28.89,22.86 45.72,22.86 | 45.72,22.86 48.89,22.86 | 48.89,22.86 63.82,22.86 | 63.82,22.86 79.69,22.86 | 79.69,22.86 83.5,22.86 | 83.5,22.86 99.38,22.86 | 99.38,22.86 103.19,22.86 | 103.19,22.86 119.06,22.86 | 119.06,22.86 121.6,22.86 T13.E | R29.2 119.06,22.86 | T14.E 103.19,22.86 | R34.2 99.38,22.86 | T5.E 83.5,22.86 | R9.2 79.69,22.86 | R7.2 28.89,22.86 | T6.E 45.72,22.86 | R6.2 48.89,22.86 | T7.E 25.72,22.86 | R8.2 9.21,22.86 | v63.82,28.57 63.82,22.86
  Bottom 0.406: DIG.P$6 63.18,29.21 v63.82,28.57
N$41
  Bottom 0.406: DIG.P$2 73.34,30.48 73.66,30.16 89.22,30.16 89.53,29.85 R32.1
N$42  (via drill 0.6)
  Top 0.406: SZ.P$5 65.72,4.45 63.82,6.35 v63.82,14.92
  Bottom 0.406: ORA10.K0 ORA1.K0 PERC10.K0 63.18,14.92 v63.82,14.92 PERC1.K0 M.PERC10.K0 M.PERC1.K0
N$44
  Top 0.61: L2.2 32.7,55.56 32.07,54.93 D1.A
  Bottom 0.61: Q1.D 20.32,52.71 20.64,52.39 R3.2 D1.A
N$45  (via drill 0.6)
  Top 0.406: SZ.P$6 63.18,4.76 62.55,5.4 v62.55,15.87
  Bottom 0.406: ORA10.K1 ORA1.K1 PERC10.K1 v62.55,15.87 63.82,15.87 PERC1.K1 M.PERC10.K1 M.PERC1.K1
N$46
  Bottom 0.406: U$2.P$23 DS18B20.P$2 102.87,51.65 R38.1
N$47
  Bottom 0.406: DIG.P$8 58.1,28.89 R15.1
N$48
  Bottom 0.406: DIG.P$10 19.68,31.75 19.05,31.12 R23.1
N$52
  Bottom 0.406: IC6.19 66.99,52.71 67.63,52.07 68.9,52.07 69.53,51.43 69.53,44.45 VFD.P$3
N$53
  Bottom 0.406: IC6.18 68.26,53.98 69.53,52.71 71.44,52.71 72.07,52.07 72.07,44.45 VFD.P$2
N$54
  Top 0.305: 116.78,9.46 116.52,9.21 111.12,9.21 | 108.27,12.06 102.42,12.06
  Top 0.406: LED1.2-DOUT 116.78,9.46 | 111.12,9.21 108.27,12.06 | 102.42,12.06 LED2.4-DIN
N$55
  Top 0.305: 96.14,9.46 95.89,9.21 91.44,9.21 | 88.58,12.06 77.98,12.06
  Top 0.406: LED2.2-DOUT 96.14,9.46 | 91.44,9.21 88.58,12.06 | 77.98,12.06 LED3.4-DIN
N$56  (via drill 0.6)
  Top 0.406: SZ.P$4 68.26,4.13 65.09,7.3 v65.09,13.97
  Bottom 0.406: ORA10.K2 ORA1.K2 PERC10.K2 64.45,13.97 v65.09,13.97 PERC1.K2 M.PERC10.K2 M.PERC1.K2
N$57
  Top 0.406: SZ.P$10 45.09,2.86 44.13,3.81 44.13,11.43 44.77,12.06 PERC10.K3
  Bottom 0.406: ORA10.K3 ORA1.K3 PERC10.K3 PERC1.K3 M.PERC10.K3 M.PERC1.K3
N$58  (via drill 0.6)
  Top 0.406: SZ.P$1 81.28,2.86 81.92,3.49 v81.92,8.25
  Bottom 0.406: ORA10.K4 ORA1.K4 PERC10.K4 PERC1.K4 v81.92,8.25 82.55,8.25 M.PERC10.K4 M.PERC1.K4
N$59
  Top 0.406: PERC1.K5 72.07,5.4 73.34,4.13 SZ.P$2
  Bottom 0.406: ORA10.K5 ORA1.K5 PERC10.K5 PERC1.K5 M.PERC10.K5 M.PERC1.K5
N$60
  Bottom 0.406: IC6.17 69.53,53.98 69.85,53.66 73.98,53.66 74.61,53.02 74.61,44.45 VFD.P$1
N$61
  Top 0.406: SZ.P$9 55.56,5.08 PERC10.K6
  Bottom 0.406: ORA10.K6 ORA1.K6 PERC10.K6 PERC1.K6 M.PERC10.K6 M.PERC1.K6
N$62
  Top 0.406: SZ.P$8 PERC10.K7
  Bottom 0.406: ORA10.K7 ORA1.K7 PERC10.K7 PERC1.K7 M.PERC10.K7 M.PERC1.K7
N$63
  Top 0.406: SZ.P$7 60.64,8.57 60.01,9.21 PERC10.K8
  Bottom 0.406: ORA10.K8 ORA1.K8 PERC10.K8 PERC1.K8 M.PERC10.K8 M.PERC1.K8
N$64  (via drill 0.6)
  Top 0.406: SZ.P$3 70.8,4.76 70.17,5.4 68.58,5.4 66.36,7.62 v66.36,13.02
  Bottom 0.406: ORA10.K9 ORA1.K9 PERC10.K9 v66.36,13.02 PERC1.K9 M.PERC10.K9 M.PERC1.K9
N$65  (via drill 0.6)
  Top 0.305: 57.47,11.11 58.42,10.16 v61.6,10.16 | 67.94,9.21 71.44,9.21
  Top 0.406: LED3.2-DOUT 71.69,9.46 71.44,9.21 | 57.47,11.11 57.47,11.94 LED4.4-DIN | v67.31,10.16 67.94,9.21
  Bottom 0.406: v61.6,10.16 v67.31,10.16
N$66  (via drill 0.6)
  Top 0.305: 32.89,12.06 37.15,12.06 | 46.67,9.21 50.8,9.21
  Top 0.406: LED4.2-DOUT 51.06,9.46 50.8,9.21 | 32.89,12.06 LED5.4-DIN | 37.15,12.06 37.46,11.75 v37.46,10.16 | v45.72,10.16 46.67,9.21
  Bottom 0.406: v37.46,10.16 v45.72,10.16
N$67
  Bottom 0.406: DIG.P$9 55.56,30.48 55.25,30.16 39.37,30.16 39.05,29.85 R22.1
N$68
  Bottom 0.406: DIG.P$7 60.64,29.21 R24.1
N$69
  Bottom 0.406: DIG.P$3 70.8,28.57 R14.1
N$70
  Top 0.61: 22.75,50.17 X2.1
  Top 0.813: D2.A 22.75,50.17
N$71
  Top 0.305: 122.87,13.97 127,13.97
  Top 0.406: LED1.4-DIN 122.37,13.46 122.87,13.97 | 127,13.97 127.64,14.6 127.64,29.21 127,29.85 68.9,29.85 68.26,30.48 DIG.P$4
N$72
  Top 0.305: U$2.P$2 107.53,72.39 R36.1
  Bottom 0.406: S.P$2 102.87,69.21 U$2.P$2
N$73
  Bottom 0.406: S1.P$2 88.9,76.84 89.53,77.47 98.74,77.47 99.06,77.15 99.06,73.66 U$2.P$8
N$74
  Top 0.406: X1.2 103.03,58.25 102.87,58.42 102.87,60.64 102.55,60.96 R39.1
N$75
  Top 0.406: R40.2 87.63,62.55 87,63.18 U$1.5
N$76
  Top 0.406: R39.2 98.11,60.96 97.47,61.6 86.36,61.6 85.73,62.23 U$1.6
N$77
  Top 0.406: X1.3 104.14,59.06 103.82,59.37 103.82,62.23 103.51,62.55 R40.1
N$78
  Top 0.406: LED5.2-DOUT 26.61,9.46 26.35,9.21 21.91,9.21 19.05,12.06 12.26,12.06 LED6.4-DIN
N$79
  Top 0.254: T15.2 88.26,56.2 88.9,56.83 88.9,57.3 T15.4
  Top 0.305: T15.4 88.92,57.8 89.53,58.42 U$1.14
N$80
  Top 0.305: Q2.3 79.21,65.66 C20.2 79.48,65.72 80.33,65.72 81.12,64.92 U$1.8
N$81
  Top 0.305: C16.2 74.4,18.31 74.29,18.41
  Top 0.406: LED6.1-VDD 6.92,12.7 7.94,12.7 8.67,13.44 C13.2 8.57,14.92 8.57,18.41 | C16.2 74.4,13.12 73.98,12.7 72.64,12.7 LED3.1-VDD | LED1.1-VDD 117.73,12.7 119.06,12.7 119.48,13.12 C18.2 119.48,17.68 118.75,18.41 | LED2.1-VDD 97.09,12.7 98.42,12.7 98.84,13.12 C17.2 98.74,14.92 98.74,18.41 | LED4.1-VDD 52,12.7 53.34,12.7 53.76,13.12 C15.2 53.66,14.92 53.66,18.41 | 29.21,18.41 29.21,14.5 | LED5.1-VDD 27.56,12.7 28.89,12.7 29.21,13.02 29.21,14.5 | 29.21,14.5 C14.2
  Top 0.61: 118.75,18.41 98.74,18.41 74.29,18.41 53.66,18.41 29.21,18.41 8.57,18.41 4.13,18.41 3.81,18.73 3.81,29.21 4.45,29.85 65.09,29.85 65.72,30.48 DIG.P$5 GND-5V.P$2
N$82
  Bottom 0.406: M.PERC1.A 125.41,16.83 126.05,17.46 R27.1
N$83
  Bottom 0.406: M.PERC10.A 105.73,16.83 106.36,17.46 R28.1
N$84
  Bottom 0.406: T13.C 124.78,26.67 R27.2
N$85
  Bottom 0.406: T14.C 105.09,26.67 R28.2
N$86
  Bottom 0.406: T11.C 114.93,26.67 116.2,25.4 R30.1
N$87
  Bottom 0.406: T11.B 110.17,24.13 109.22,23.18 R31.2
N$88
  Bottom 0.406: T12.B 90.17,24.13 89.53,23.49 R32.2
N$89
  Top 0.305: U$1.7 84.45,61.6 84.14,61.28 80.96,61.28 Q2.1 | 80.96,60.98 Q2.1 | C21.1 81.18,60.76 Q2.1
N$90
  Bottom 0.406: T13.B 120.33,24.13 119.06,25.4 R29.1 R30.2
N$91
  Bottom 0.406: T14.B 100.96,24.13 99.38,25.72 R34.1 R33.2
N$92
  Top 0.406: U$2.P$22 RX/TX.P$2
N$93
  Top 0.406: U$2.P$24 RX/TX.P$3
N$94
  Bottom 0.305: T16.C 83.65,56.68 SG1.-
N$95  (via drill 0.6)
  Top 0.305: U$2.P$5 100.33,76.2 99.7,76.84 78.74,76.84 78.11,76.2 v78.11,55.56
  Bottom 0.305: v78.11,55.56 78.11,51.75 78.74,51.12 81.13,51.12 T16.B
N$96
  Top 0.305: J1.2 111.76,70.17 111.12,70.8 107,70.8 106.36,70.49 100.96,70.49 100.33,71.12 U$2.P$6
  Bottom 0.305: R43.1 110.91,70.7 J1.2
N$97
  Top 0.254: 45.18,61.05 45.79,61.05
N$98  (via drill 1)
  Top 0.406: R35.A 48.52,68.64 49.06,68.1 R25.1
  Bottom 0.406: R35.A 46.63,71.4 v46.67,71.44
N$99  (via drill 1)
  Top 0.254: U$3.FB 46.36,62.55 46.67,62.86
  Top 0.406: R35.E 43.76,68.64 44.13,68.26 44.13,66.13 R35.S 46.3,66.1 46.67,65.72 46.67,62.86
  Bottom 0.406: C1.2 44.25,65.94 R35.S | R26.2 41.32,68.87 R35.E 41.59,68.67 v41.59,71.44
N$104
  Bottom 0.406: T12.C 94.93,26.99 96.52,25.4 R33.1
N$105  (via drill 0.6)
  Top 0.406: v68.26,17.15 62.23,17.15 61.6,16.51 61.6,11.43 61.28,11.11 PERC10.DP
  Bottom 0.406: ORA10.DP ORA1.DP PERC10.DP PERC1.DP M.PERC10.DP M.PERC1.DP | v68.26,17.15 68.26,26.04 67.63,26.67 T10.C
N$119
  Bottom 0.406: T9.B 23.49,73.98 24.13,74.61 R19.S
P1
  Top 0.406: NIXI.P$3 72.07,44.45 72.07,41.59 72.39,41.28 80.01,41.28 81.6,42.86 89.85,42.86 90.17,43.18 U$2.P$32
P10  (via drill 0.6)
  Top 0.406: v58.1,52.71 87.31,52.71 92.71,47.31 U$2.P$29
  Bottom 0.406: v58.1,52.71 NIXI.P$8
PRG  (via drill 0.6)
  Top 0.254: v86.04,57.47 87.46,57.47 T15.6
  Top 0.406: U$2.P$33 87.63,48.58 v86.04,50.17
  Bottom 0.406: v86.04,50.17 v86.04,57.47
RGB
  Top 0.406: NIXI.P$4 68.26,47.31 68.58,47.63 81.6,47.63 82.55,46.67 82.55,45.09 83.18,44.45 U$2.P$36
  Bottom 0.61: NIXI.P$4 VFD.P$4
SCL
  Top 0.406: I2C.P$2 93.66,42.86 96.2,42.86 96.52,43.18 96.52,45.72 U$2.P$25
  Bottom 0.406: R41.1 U$2.P$25
SDA
  Bottom 0.406: I2C.P$3 91.12,42.86 93.66,42.86 U$2.P$28 96.52,45.72 96.52,48.26 95.89,48.89 R42.1
VBB  (via drill 0.6)
  Top 0.61: v50.48,48.26 62.55,48.26 63.18,47.63 NIXI.P$6
  Bottom 0.406: 44.13,67.31 44.13,76.2 44.77,76.84 R20.2
  Bottom 0.61: IC6.1 44.13,67.31 38.1,67.31 37.15,66.36 D1.C 37.15,48.58 37.59,48.13 43.82,48.13 | v50.48,48.26 50.36,48.13 43.82,48.13 | C7.+ 43.82,48.13
Ó1  (via drill 0.6)
  Top 0.406: v55.56,53.66 88.26,53.66 93.98,47.94 93.98,45.72 U$2.P$30
  Bottom 0.406: v55.56,53.66 NIXI.P$9
Ó10  (via drill 0.6)
  Top 0.406: v53.02,54.61 88.9,54.61 95.25,48.26 U$2.P$27
  Bottom 0.406: v53.02,54.61 NIXI.P$10

### Text on the board
Top: 1 | UNFI | Z573M
Bottom: UNFI | Z573M
tPlace: ESP-32 UNICLOCK | 5V DC | UNFI | UNFI | ESP-32 UNICLOCK